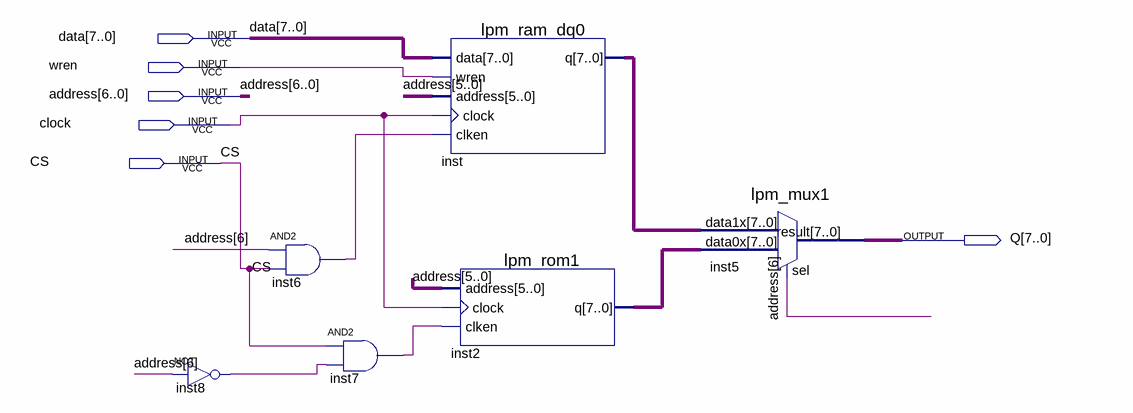
[diagram p0: schematic sheet]
// Quartus schematic Pro3_1.bdf as structural Verilog: 6 symbols, 6 pins
module Pro3_1 (
  input  [7:0] data,
  input  wren,
  input  [6:0] address,
  input  clock,
  input  CS,
  output [7:0] Q
);

  wire inst6_out, inst7_out, inst8_out;
  wire [7:0] inst2_q, inst_q;

  not inst8 (inst8_out, address[6]);
  and inst6 (inst6_out, address[6], CS);
  and inst7 (inst7_out, CS, inst8_out);
  lpm_ram_dq0 inst (.data(data), .wren(wren), .address(address[5:0]), .clock(clock), .clken(inst6_out), .q(inst_q));
  lpm_rom1 inst2 (.address(address[5:0]), .clock(clock), .clken(inst7_out), .q(inst2_q));
  lpm_mux1 inst5 (.data1x(inst_q), .data0x(inst2_q), .sel(address[6]), .result(Q));
endmodule
